# Altium schematic sheet STM32.SchDoc
size A4
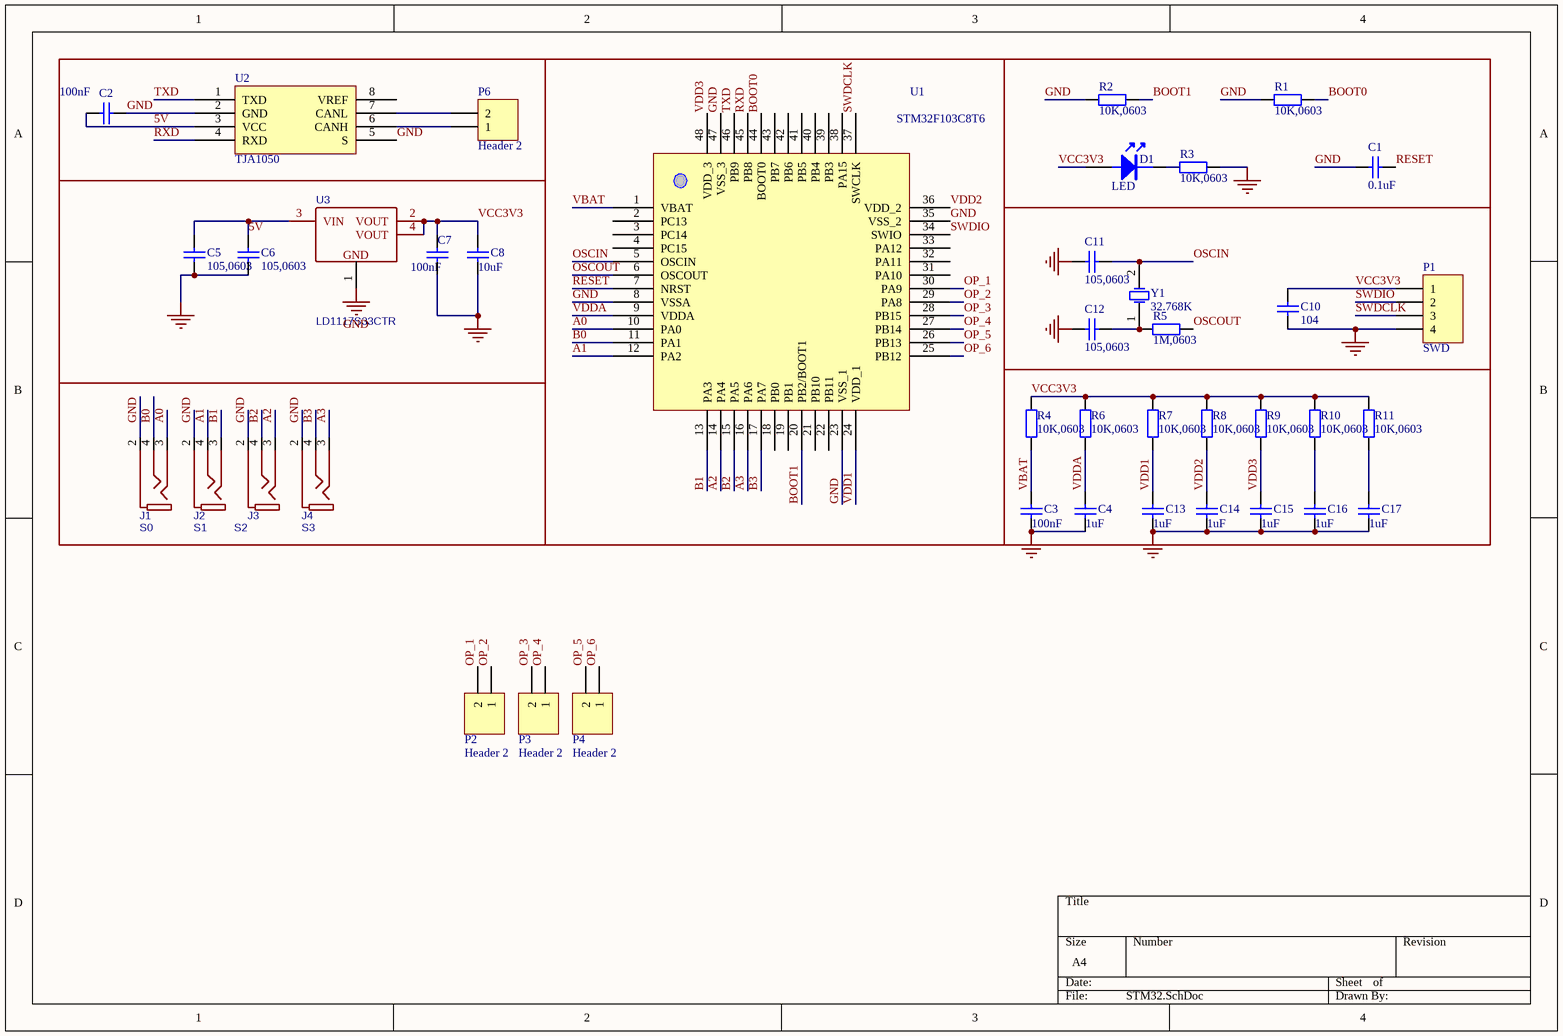
[diagram p0: STM32.SchDoc]

## Parts
C1  0.1uF  [0805]
C2  100nF  [0805]
C3  100nF  [0805]
C4  1uF  [0805]
C5  105,0603  [0805]
C6  105,0603  [0805]
C7  value 100nF  [0805]
C8  value 10uF  [0805]  (hidden comment: 105,0603)
C10  104  [0805]
C11  105,0603  [0805]
C12  105,0603  [0805]
C13  1uF  [0805]
C14  1uF  [0805]
C15  1uF  [0805]
C16  1uF  [0805]
C17  1uF  [0805]
D1  LED  [LED]
J1  S0  [AUDIO-PJ313D]
J2  S1  [AUDIO-PJ313D]
J3  S2  [AUDIO-PJ313D]
J4  S3  [AUDIO-PJ313D]
P1  SWD  [HDR1X4H]
P2  Header 2  [HDR1X2]
P3  Header 2  [HDR1X2]
P4  Header 2  [HDR1X2]
P6  Header 2  [HDR1X2]
R1  10K,0603  [0805]
R2  10K,0603  [0805]
R3  10K,0603  [0805]
R4  10K,0603  [0805]
R5  1M,0603  [0805]
R6  10K,0603  [0805]
R7  10K,0603  [0805]
R8  10K,0603  [0805]
R9  10K,0603  [0805]
R10  10K,0603  [0805]
R11  10K,0603  [0805]
U1  STM32F103C8T6  [48P]
U2  TJA1050  [SOIC-8_150MIL]
U3  LD1117S33CTR  [SOT-223]
Y1  32.768K  [XTAL1]

## Nets
GND: C1.1 C2.1 C3.1 C4.1 C5.1 C6.1 C7.1 C8.1 C10.1 C11.1 C12.1 C13.1 C14.1 C15.1 C16.1 C17.1 J1.2 J2.2 J3.2 J4.2 P1.4 R1.1 R2.1 R3.2 U1.8(VSSA) U1.23(VSS_1) U1.35(VSS_2) U1.47(VSS_3) U2.2(GND) U2.5(S) U3.1(GND)
5V: C2.2 C5.2 C6.2 U2.3(VCC) U3.3(VIN)
A0: J1.3 U1.10(PA0)
A1: J2.4 U1.12(PA2)
A2: J3.3 U1.14(PA4)
A3: J4.3 U1.16(PA6)
B0: J1.4 U1.11(PA1)
B1: J2.3 U1.13(PA3)
B2: J3.4 U1.15(PA5)
B3: J4.4 U1.17(PA7)
BOOT0: R1.2 U1.44(BOOT0)
BOOT1: R2.2 U1.20(PB2/BOOT1)
OP_1: P2.2 U1.30(PA9)
OP_2: P2.1 U1.29(PA8)
OP_3: P3.2 U1.28(PB15)
OP_4: P3.1 U1.27(PB14)
OP_5: P4.2 U1.26(PB13)
OP_6: P4.1 U1.25(PB12)
OSCIN: C11.2 U1.5(OSCIN) Y1.2(OSC2)
OSCOUT: R5.1 U1.6(OSCOUT)
RESET: C1.2 U1.7(NRST)
RXD: U1.45(PB8) U2.4(RXD)
SWDCLK: P1.3 U1.37(SWCLK)
SWDIO: P1.2 U1.34(SWIO)
TXD: U1.46(PB9) U2.1(TXD)
VBAT: C3.2 R4.1 U1.1(VBAT)
VCC3V3: C7.2 C8.2 C10.2 D1.A P1.1 R4.2 R6.2 R7.2 R8.2 R9.2 R10.2 R11.2 U3.2(VOUT) U3.4(VOUT)
VDD1: C13.2 R7.1 U1.24(VDD_1)
VDD2: C14.2 R8.1 U1.36(VDD_2)
VDD3: C15.2 R9.1 U1.48(VDD_3)
VDDA: C4.2 R6.1 U1.9(VDDA)
NetC12_2: C12.2 R5.2 Y1.1(OSC1)
NetC16_2: C16.2 R10.1
NetC17_2: C17.2 R11.1
NetD1_K: D1.K R3.1
NetP6_1: P6.1 U2.6(CANH)
NetP6_2: P6.2 U2.7(CANL)

Not connected (* = marked no-connect by the designer): U1 2(PC13) 3(PC14) 4(PC15) 18(PB0) 19(PB1) 21(PB10) 22(PB11) 31(PA10) 32(PA11) 33(PA12) 38(PA15) 39(PB3) 40(PB4) 41(PB5) 42(PB6) 43(PB7); U2 8(VREF)

## Library data of the parts
C1-C6 C11-C17 = Cap: Capacitor; Value: 104; Published: 8-Jun-2000; LatestRevisionDate: 17-Jul-2002; LatestRevisionNote: Re-released for DXP Platform.; Publisher: Altium Limited
C7 C8 C10 = Cap: Capacitor; Published: 8-Jun-2000; LatestRevisionDate: 17-Jul-2002; LatestRevisionNote: Re-released for DXP Platform.; Publisher: Altium Limited
  C10: Value: 104
D1 = LED: pin to pad: A>1 K>2
J1-J4 = Stereo-jack: BOM_Manufacturer: BOOMELE; BOM_Manufacturer Part: Straight headphone jack; BOM_Supplier: LCSC; BOM_Supplier Part: C18167; spicePre: J
P1 = Header 4: Header, 4-Pin; LatestRevisionDate: 17-Jul-2002; LatestRevisionNote: Re-released for DXP Platform.; Publisher: Altium Limited
P2-P4 P6 = Header 2: Header, 2-Pin; LatestRevisionDate: 17-Jul-2002; LatestRevisionNote: Re-released for DXP Platform.; Publisher: Altium Limited
R1-R11 = Res2: Resistor; Published: 8-Jun-2000; LatestRevisionDate: 17-Jul-2002; LatestRevisionNote: Re-released for DXP Platform.; Publisher: Altium Limited
U3 = LD1117S33CTR: BOM_Manufacturer: STMicroelectronics; BOM_Supplier: LCSC; BOM_Manufacturer Part: LD1117S33CTR; image: //image.lceda.cn/szlcsc/C35879.jpg; BOM_Supplier Part: C35879; spicePre: U
Y1 = XTAL: Crystal Oscillator; Published: 8-Jun-2000; LatestRevisionDate: 17-Jul-2002; LatestRevisionNote: Re-released for DXP Platform.; Publisher: Altium Limited